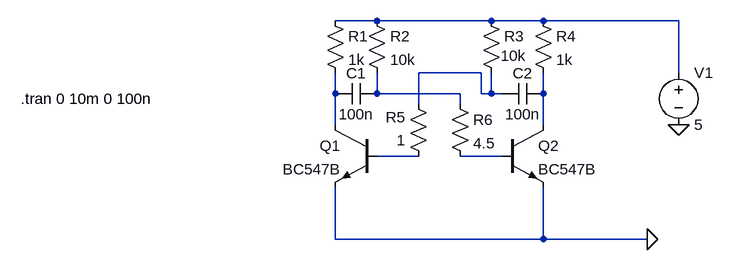
[diagram p0: schematic Astable_multivibrator.asc]
Astable_multivibrator.asc, the LTspice schematic file:
Version 4
SHEET 1 880 680
WIRE -128 0 -192 0
WIRE 48 0 -128 0
WIRE 128 0 48 0
WIRE 336 0 128 0
WIRE 32 80 -64 80
WIRE 336 80 336 0
WIRE -192 112 -192 80
WIRE -128 112 -128 80
WIRE 0 112 -128 112
WIRE 32 112 32 80
WIRE 48 112 48 80
WIRE 48 112 32 112
WIRE 64 112 48 112
WIRE 128 112 128 80
WIRE -64 128 -64 80
WIRE 0 128 0 112
WIRE -192 160 -192 112
WIRE 128 160 128 112
WIRE -64 208 -128 208
WIRE 64 208 0 208
WIRE -192 336 -192 256
WIRE 128 336 128 256
WIRE 128 336 -192 336
WIRE 288 336 128 336
FLAG 336 160 0
FLAG 288 336 0
SYMBOL voltage 336 64 R0
WINDOW 123 0 0 Left 0
WINDOW 39 0 0 Left 0
SYMATTR InstName V1
SYMATTR Value 5
SYMBOL res -208 -16 R0
SYMATTR InstName R1
SYMATTR Value 1k
SYMBOL cap -128 96 R90
WINDOW 0 0 32 VBottom 2
WINDOW 3 32 32 VTop 2
SYMATTR InstName C1
SYMATTR Value 100n
SYMBOL cap 128 96 R90
WINDOW 0 0 32 VBottom 2
WINDOW 3 32 32 VTop 2
SYMATTR InstName C2
SYMATTR Value 100n
SYMBOL res -144 -16 R0
SYMATTR InstName R2
SYMATTR Value 10k
SYMBOL res 32 -16 R0
WINDOW 3 30 70 Left 2
SYMATTR InstName R3
SYMATTR Value 10k
SYMBOL res 112 -16 R0
SYMATTR InstName R4
SYMATTR Value 1k
SYMBOL npn -128 160 M0
SYMATTR InstName Q1
SYMATTR Value BC547B
SYMBOL npn 64 160 R0
SYMATTR InstName Q2
SYMATTR Value BC547B
SYMBOL res -48 224 R180
WINDOW 0 36 76 Left 2
WINDOW 3 36 40 Left 2
SYMATTR InstName R5
SYMATTR Value 1
SYMBOL res -16 112 R0
SYMATTR InstName R6
SYMATTR Value 4.5
TEXT -676 120 Left 2 !.tran 0 10m 0 100n

The netlist it stands for:
* Astable_multivibrator.asc
V1 N001 0 5
R1 N001 N003 1k
C1 N004 N003 100n
C2 N005 N002 100n
R2 N001 N004 10k
R3 N001 N002 10k
R4 N001 N005 1k
Q1 N003 N006 0 0 BC547B
Q2 N005 N007 0 0 BC547B
R5 N006 N002 1
R6 N004 N007 4.5
.model NPN NPN
.model PNP PNP
.lib standard.bjt
.tran 0 10m 0 100n
.backanno
.end